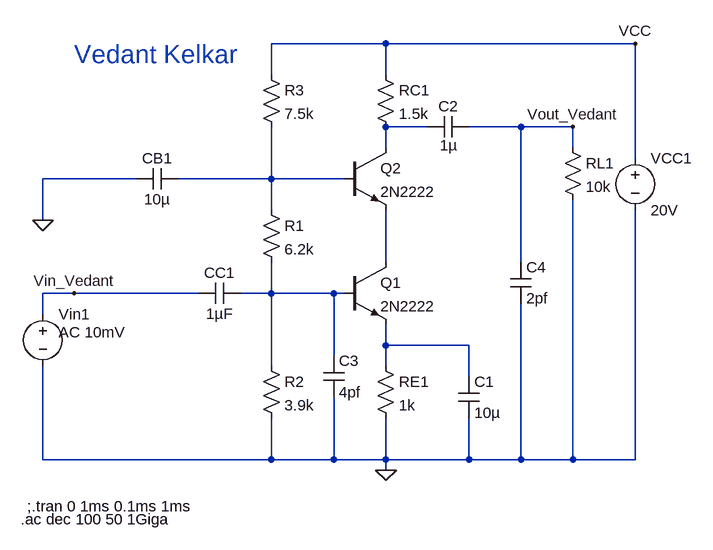
[diagram p0: schematic ECAD_exp5b.asc]
ECAD_exp5b.asc, the LTspice schematic file:
Version 4
SHEET 1 880 680
WIRE 192 -208 16 -208
WIRE 576 -208 192 -208
WIRE 16 -160 16 -208
WIRE 192 -160 192 -208
WIRE 256 -80 192 -80
WIRE 400 -80 320 -80
WIRE 480 -80 400 -80
WIRE 192 -48 192 -80
WIRE 480 -48 480 -80
WIRE 576 -32 576 -208
WIRE -192 0 -336 0
WIRE 16 0 16 -80
WIRE 16 0 -128 0
WIRE 128 0 16 0
WIRE 16 48 16 0
WIRE -336 64 -336 0
WIRE 192 128 192 48
WIRE 400 128 400 -80
WIRE -288 176 -336 176
WIRE -96 176 -288 176
WIRE 16 176 16 128
WIRE 16 176 -32 176
WIRE 112 176 16 176
WIRE 128 176 112 176
WIRE -336 208 -336 176
WIRE 192 256 192 224
WIRE 320 256 192 256
WIRE 112 272 112 176
WIRE 16 288 16 176
WIRE 192 288 192 256
WIRE 320 304 320 256
WIRE -336 432 -336 288
WIRE 16 432 16 368
WIRE 16 432 -336 432
WIRE 112 432 112 336
WIRE 112 432 16 432
WIRE 192 432 192 368
WIRE 192 432 112 432
WIRE 320 432 320 368
WIRE 320 432 192 432
WIRE 400 432 400 192
WIRE 400 432 320 432
WIRE 480 432 480 32
WIRE 480 432 400 432
WIRE 576 432 576 48
WIRE 576 432 480 432
WIRE 192 448 192 432
FLAG 192 448 0
FLAG -288 176 Vin_Vedant
FLAG -336 64 0
FLAG 480 -80 Vout_Vedant
FLAG 576 -208 VCC
SYMBOL res 0 32 R0
SYMATTR InstName R1
SYMATTR Value 6.2k
SYMBOL res 176 272 R0
SYMATTR InstName RE1
SYMATTR Value 1k
SYMBOL res 0 272 R0
SYMATTR InstName R2
SYMATTR Value 3.9k
SYMBOL cap -32 160 R90
WINDOW 0 0 32 VBottom 2
WINDOW 3 32 32 VTop 2
SYMATTR InstName CC1
SYMATTR Value 1µF
SYMBOL voltage -336 192 R0
WINDOW 123 24 44 Left 2
WINDOW 39 0 0 Left 0
WINDOW 3 21 91 Left 2
SYMATTR Value2 AC 10mV
SYMATTR Value ""
SYMATTR InstName Vin1
SYMBOL npn 128 128 R0
SYMATTR InstName Q1
SYMATTR Value 2N2222
SYMBOL cap 304 304 R0
SYMATTR InstName C1
SYMATTR Value 10µ
SYMATTR SpiceLine V=6.3 Irms=0 Rser=0.001 Lser=0 mfg="TDK" pn="C3216X5ROJ106M" type="X5R"
SYMBOL npn 128 -48 R0
SYMATTR InstName Q2
SYMATTR Value 2N2222
SYMBOL res 0 -176 R0
SYMATTR InstName R3
SYMATTR Value 7.5k
SYMBOL res 176 -176 R0
SYMATTR InstName RC1
SYMATTR Value 1.5k
SYMBOL cap 320 -96 R90
WINDOW 0 0 32 VBottom 2
WINDOW 3 29 31 VTop 2
SYMATTR InstName C2
SYMATTR Value 1µ
SYMBOL res 464 -64 R0
SYMATTR InstName RL1
SYMATTR Value 10k
SYMBOL voltage 576 -48 R0
WINDOW 123 0 0 Left 0
WINDOW 39 0 0 Left 0
SYMATTR InstName VCC1
SYMATTR Value 20V
SYMBOL cap -128 -16 R90
WINDOW 0 0 32 VBottom 2
WINDOW 3 32 32 VTop 2
SYMATTR InstName CB1
SYMATTR Value 10µ
SYMBOL cap 96 272 R0
SYMATTR InstName C3
SYMATTR Value 4pf
SYMBOL cap 384 128 R0
SYMATTR InstName C4
SYMATTR Value 2pf
TEXT -288 -192 Left 4 ;Vedant Kelkar
TEXT -360 504 Left 2 !;.tran 0 1ms 0.1ms 1ms
TEXT -370 524 Left 2 !.ac dec 100 50 1Giga

The netlist it stands for:
* ECAD_exp5b.asc
R1 N002 N004 6.2k
RE1 N005 0 1k
R2 N004 0 3.9k
CC1 N004 Vin_Vedant 1µF
Vin1 Vin_Vedant 0 AC 10mV
Q1 N003 N004 N005 0 2N2222
C1 N005 0 10µ V=6.3 Irms=0 Rser=0.001 Lser=0 mfg="TDK" pn="C3216X5ROJ106M" type="X5R"
Q2 N001 N002 N003 0 2N2222
R3 VCC N002 7.5k
RC1 VCC N001 1.5k
C2 Vout_Vedant N001 1µ
RL1 Vout_Vedant 0 10k
VCC1 VCC 0 20V
CB1 N002 0 10µ
C3 N004 0 4pf
C4 Vout_Vedant 0 2pf
.model NPN NPN
.model PNP PNP
.lib standard.bjt
* Vedant Kelkar
;.tran 0 1ms 0.1ms 1ms
.ac dec 100 50 1Giga
.backanno
.end